# Altium schematic sheet KV7500_PLC.SchDoc
size A3; PageSetup: Record=PageOptions|CenterHorizontal=True|CenterVertical=True|PrintScale=1.00|XCorrection=1.00|YCorrection=1.00|PrintKind=2|BorderSize=5000000|LeftOffset=0|BottomOffset=0|Orientation=2|PaperLength=1000|PaperWidth=1000|Scale=100|PaperSource=7|PrintQuality=-4|MediaType=1|DitherType=10|PaperKind=A3|PrintScaleMode=1
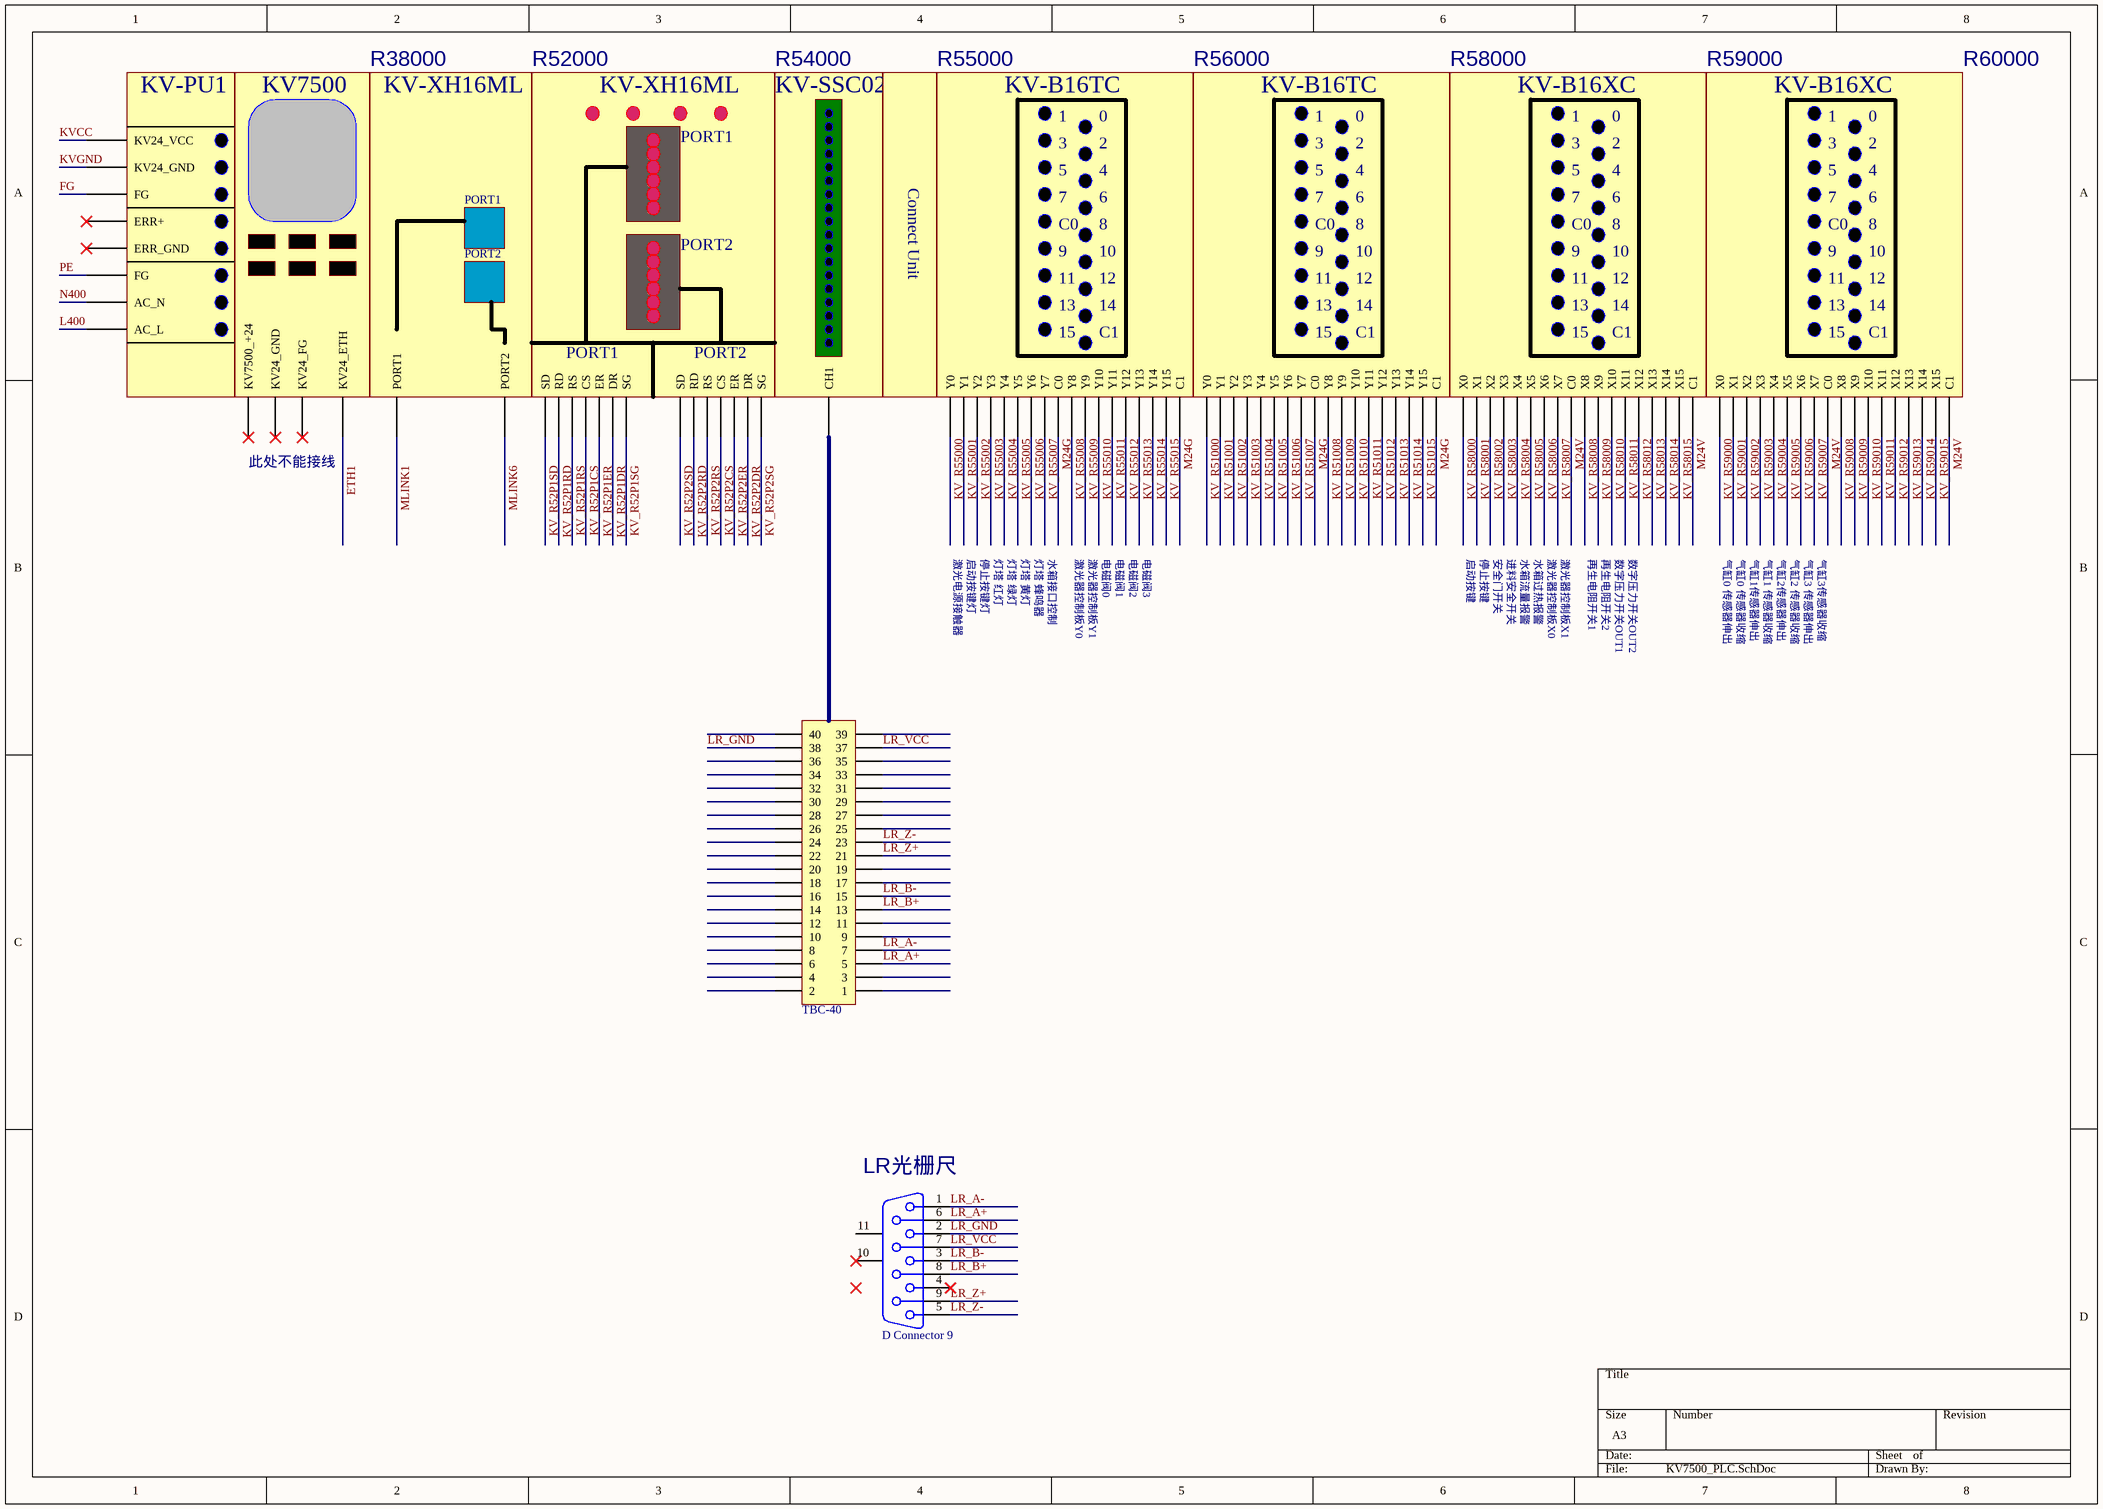
[diagram p0: KV7500_PLC.SchDoc]

## Parts
(Parts that share a designator on the sheet are numbered #1, #2 ... from top to bottom, then left to right.)
*#1  KV-PU1  (value not drawn)
*#2  KV7500  (value not drawn)
*#3  KV-XH16ML  (value not drawn)
*#4  KV-XL202  (value not drawn)
*#5  KV-SSC02  (value not drawn)
*#6  KV-CU  (value not drawn)
*#7  KV-B16TC  (value not drawn)
*#8  KV-B16TC  (value not drawn)
*#9  KV-B16XC  (value not drawn)
*#10  KV-B16XC  (value not drawn)
J?  D Connector 9  [DSUB1.385-2H9]
P?  TBC-40  [HDR2X20]

## Nets
ETH1: *#2.201(KV7500_+24)
FG: *#1.196(FG)
KV_R52P1CS: *#4.208(CS)
KV_R52P1DR: *#4.210(DR)
KV_R52P1ER: *#4.209(ER)
KV_R52P1RD: *#4.206(RD)
KV_R52P1RS: *#4.207(RS)
KV_R52P1SD: *#4.205(SD)
KV_R52P1SG: *#4.211(SG)
KV_R52P2CS: *#4.208(CS)
KV_R52P2DR: *#4.210(DR)
KV_R52P2ER: *#4.209(ER)
KV_R52P2RD: *#4.206(RD)
KV_R52P2RS: *#4.207(RS)
KV_R52P2SD: *#4.205(SD)
KV_R52P2SG: *#4.211(SG)
KV_R51000: *#8.X18(Y0)
KV_R51001: *#8.X19(Y1)
KV_R51002: *#8.X20(Y2)
KV_R51003: *#8.X21(Y3)
KV_R51004: *#8.X22(Y4)
KV_R51005: *#8.X23(Y5)
KV_R51006: *#8.X24(Y6)
KV_R51007: *#8.X25(Y7)
KV_R51008: *#8.X26(Y8)
KV_R51009: *#8.X27(Y9)
KV_R51010: *#8.X28(Y10)
KV_R51011: *#8.X29(Y11)
KV_R51012: *#8.X30(Y12)
KV_R51013: *#8.X31(Y13)
KV_R51014: *#8.X32(Y14)
KV_R51015: *#8.X33(Y15)
KV_R55000: *#7.X18(Y0)
KV_R55001: *#7.X19(Y1)
KV_R55002: *#7.X20(Y2)
KV_R55003: *#7.X21(Y3)
KV_R55004: *#7.X22(Y4)
KV_R55005: *#7.X23(Y5)
KV_R55006: *#7.X24(Y6)
KV_R55007: *#7.X25(Y7)
KV_R55008: *#7.X26(Y8)
KV_R55009: *#7.X27(Y9)
KV_R55010: *#7.X28(Y10)
KV_R55011: *#7.X29(Y11)
KV_R55012: *#7.X30(Y12)
KV_R55013: *#7.X31(Y13)
KV_R55014: *#7.X32(Y14)
KV_R55015: *#7.X33(Y15)
KV_R58000: *#9.X0
KV_R58001: *#9.X1
KV_R58002: *#9.X2
KV_R58003: *#9.X3
KV_R58004: *#9.X4
KV_R58005: *#9.X5
KV_R58006: *#9.X6
KV_R58007: *#9.X7
KV_R58008: *#9.X9(X8)
KV_R58009: *#9.X10(X9)
KV_R58010: *#9.X11(X10)
KV_R58011: *#9.X12(X11)
KV_R58012: *#9.X13(X12)
KV_R58013: *#9.X14(X13)
KV_R58014: *#9.X15(X14)
KV_R58015: *#9.X16(X15)
KV_R59000: *#10.X0
KV_R59001: *#10.X1
KV_R59002: *#10.X2
KV_R59003: *#10.X3
KV_R59004: *#10.X4
KV_R59005: *#10.X5
KV_R59006: *#10.X6
KV_R59007: *#10.X7
KV_R59008: *#10.X9(X8)
KV_R59009: *#10.X10(X9)
KV_R59010: *#10.X11(X10)
KV_R59011: *#10.X12(X11)
KV_R59012: *#10.X13(X12)
KV_R59013: *#10.X14(X13)
KV_R59014: *#10.X15(X14)
KV_R59015: *#10.X16(X15)
KVCC: *#1.200(KV24_VCC)
KVGND: *#1.199(KV24_GND)
L400: *#1.194(AC_L)
LR_A+: J?.6 P?.5
LR_A-: J?.1 P?.7
LR_B+: J?.8 P?.13
LR_B-: J?.3 P?.15
LR_GND: J?.2 P?.38
LR_VCC: J?.7 P?.37
LR_Z+: J?.9 P?.21
LR_Z-: J?.5 P?.23
M24G: *#7.X8(C0) *#7.X17(C1) *#8.X8(C0) *#8.X17(C1)
M24V: *#9.X8(C0) *#9.X17(C1) *#10.X8(C0) *#10.X17(C1)
MLINK1: *#3.203(PORT1)
MLINK6: *#3.202(PORT2)
N400: *#1.195(AC_N)
PE: *#1.196(FG)

Not connected (* = marked no-connect by the designer): *#1 197(ERR+)* 198(ERR_GND)*; *#5 204(CH1); J? 4* 10(MH1)* 11(MH2); P? 1 2 3 4 6 8 9 10 11 12 14 16 17 18 19 20 22 24 25 26 27 28 29 30 31 32 33 34 35 36 39 40

## Notes on the sheet
- R38000
- R52000
- R54000
- R55000
- R56000
- R58000
- R59000
- R60000
- 此处不能接线
- 激光电源接触器
- 启动按键灯
- 停止按键灯
- 灯塔 红灯
- 灯塔 绿灯
- 灯塔 黄灯
- 灯塔 蜂鸣器
- 水箱接口控制
- 激光器控制板Y0
- 激光器控制板Y1
- 电磁阀0
- 电磁阀1
- 电磁阀2
- 电磁阀3
- 启动按键
- 停止按键
- 安全门开关
- 进料安全开关
- 水箱流量报警
- 水箱过热报警
- 激光器控制板X0
- 激光器控制板X1
- 再生电阻开关1
- 再生电阻开关2
- 数字压力开关OUT1
- 数字压力开关OUT2
- 气缸0 传感器伸出
- 气缸0 传感器收缩
- 气缸1传感器伸出
- 气缸1 传感器收缩
- 气缸2传感器伸出
- 气缸2 传感器收缩
- 气缸3 传感器伸出
- 气缸3传感器收缩
- (near J?) LR光栅尺
- (in symbol KV-B16TC) 1; 0; 3; 2; 5; 4; 7; 6; 8; 9; 10; 11; 12; 13; 14; 15
- (in symbol KV-B16XC) 1; 0; 3; 2; 5; 4; 7; 6; 8; 9; 10; 11; 12; 13; 14; 15
- (in symbol KV-CU) Connect Unit
- (in symbol KV-XL202) KV-XH16ML; PORT1; PORT2

## Library data of the parts
J? = D Connector 9: Receptacle Assembly, 9 Position, Right Angle; PackageDocument: O; Positions: 9; Published: 15-Jun-2001; LatestRevisionDate: 17-Jul-2002; LatestRevisionNote: Re-released for DXP Platform.; DatasheetDocument: 1-Sep-1999; PackageReference: 788750; Publisher: Altium Limited; Orientation: Right Angle; Gender: Receptacle
P? = Header 20X2: Header, 20-Pin, Dual row; LatestRevisionDate: 17-Jul-2002; LatestRevisionNote: Re-released for DXP Platform.; Publisher: Altium Limited